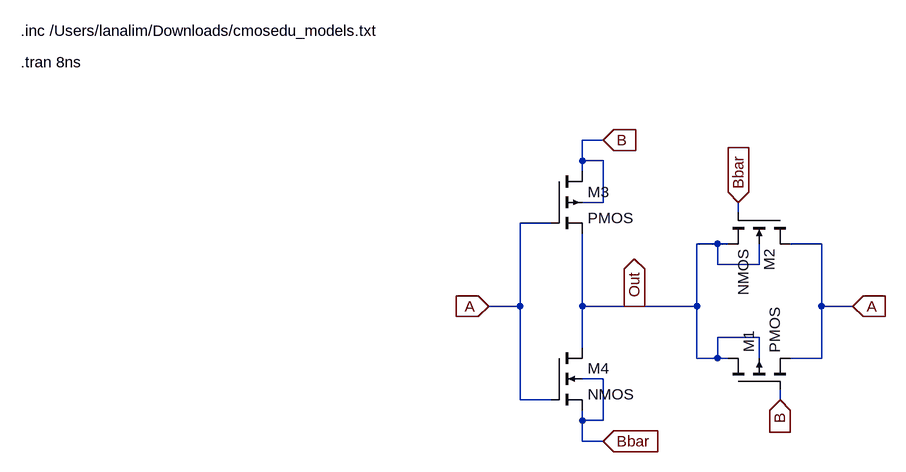
[diagram p0: schematic xor_tg1.asc]
xor_tg1.asc, the LTspice schematic file:
Version 4
SHEET 1 1620 1372
WIRE 864 416 832 416
WIRE 832 448 832 416
WIRE 864 448 832 448
WIRE 832 464 832 448
WIRE 864 512 864 448
WIRE 864 512 832 512
WIRE 1072 528 1072 512
WIRE 784 544 736 544
WIRE 1040 576 1008 576
WIRE 1056 576 1040 576
WIRE 1200 576 1152 576
WIRE 1040 608 1040 576
WIRE 1104 608 1104 576
WIRE 1104 608 1040 608
WIRE 736 672 736 544
WIRE 736 672 688 672
WIRE 832 672 832 560
WIRE 912 672 832 672
WIRE 1008 672 1008 576
WIRE 1008 672 912 672
WIRE 1200 672 1200 576
WIRE 1248 672 1200 672
WIRE 1104 720 1040 720
WIRE 832 736 832 672
WIRE 1008 752 1008 672
WIRE 1040 752 1040 720
WIRE 1040 752 1008 752
WIRE 1056 752 1040 752
WIRE 1104 752 1104 720
WIRE 1200 752 1200 672
WIRE 1200 752 1152 752
WIRE 864 784 832 784
WIRE 736 816 736 672
WIRE 784 816 736 816
WIRE 1136 816 1136 800
WIRE 832 848 832 832
WIRE 864 848 864 784
WIRE 864 848 832 848
WIRE 832 880 832 848
WIRE 864 880 832 880
FLAG 1072 512 Bbar
IOPIN 1072 512 In
FLAG 688 672 A
IOPIN 688 672 In
FLAG 864 416 B
IOPIN 864 416 In
FLAG 864 880 Bbar
IOPIN 864 880 In
FLAG 1248 672 A
IOPIN 1248 672 In
FLAG 912 672 Out
IOPIN 912 672 Out
FLAG 1136 816 B
IOPIN 1136 816 In
SYMBOL nmos4 1152 528 R90
SYMATTR InstName M2
SYMATTR Value2 l=1e-7 w=2e-7
SYMBOL pmos4 1056 800 R270
SYMATTR InstName M1
SYMATTR Value2 l=1e-7 w=2e-7
SYMBOL pmos4 784 464 R0
SYMATTR InstName M3
SYMATTR Value2 l=1e-7 w=4e-7
SYMBOL nmos4 784 736 R0
SYMATTR InstName M4
SYMATTR Value2 l=1e-7 w=2e-7
TEXT -32 248 Left 2 !.inc /Users/lanalim/Downloads/cmosedu_models.txt
TEXT -32 296 Left 2 !.tran 8ns

The netlist it stands for:
* xor_tg1.asc
M2 A Bbar Out Out NMOS l=1e-7 w=2e-7
M1 Out B A Out PMOS l=1e-7 w=2e-7
M3 B A Out B PMOS l=1e-7 w=4e-7
M4 Out A Bbar Bbar NMOS l=1e-7 w=2e-7
.model NMOS NMOS
.model PMOS PMOS
.lib standard.mos
.inc /Users/lanalim/Downloads/cmosedu_models.txt
.tran 8ns
.backanno
.end